# Altium schematic sheet Power_supply.schdoc
size 292 x 168 mm
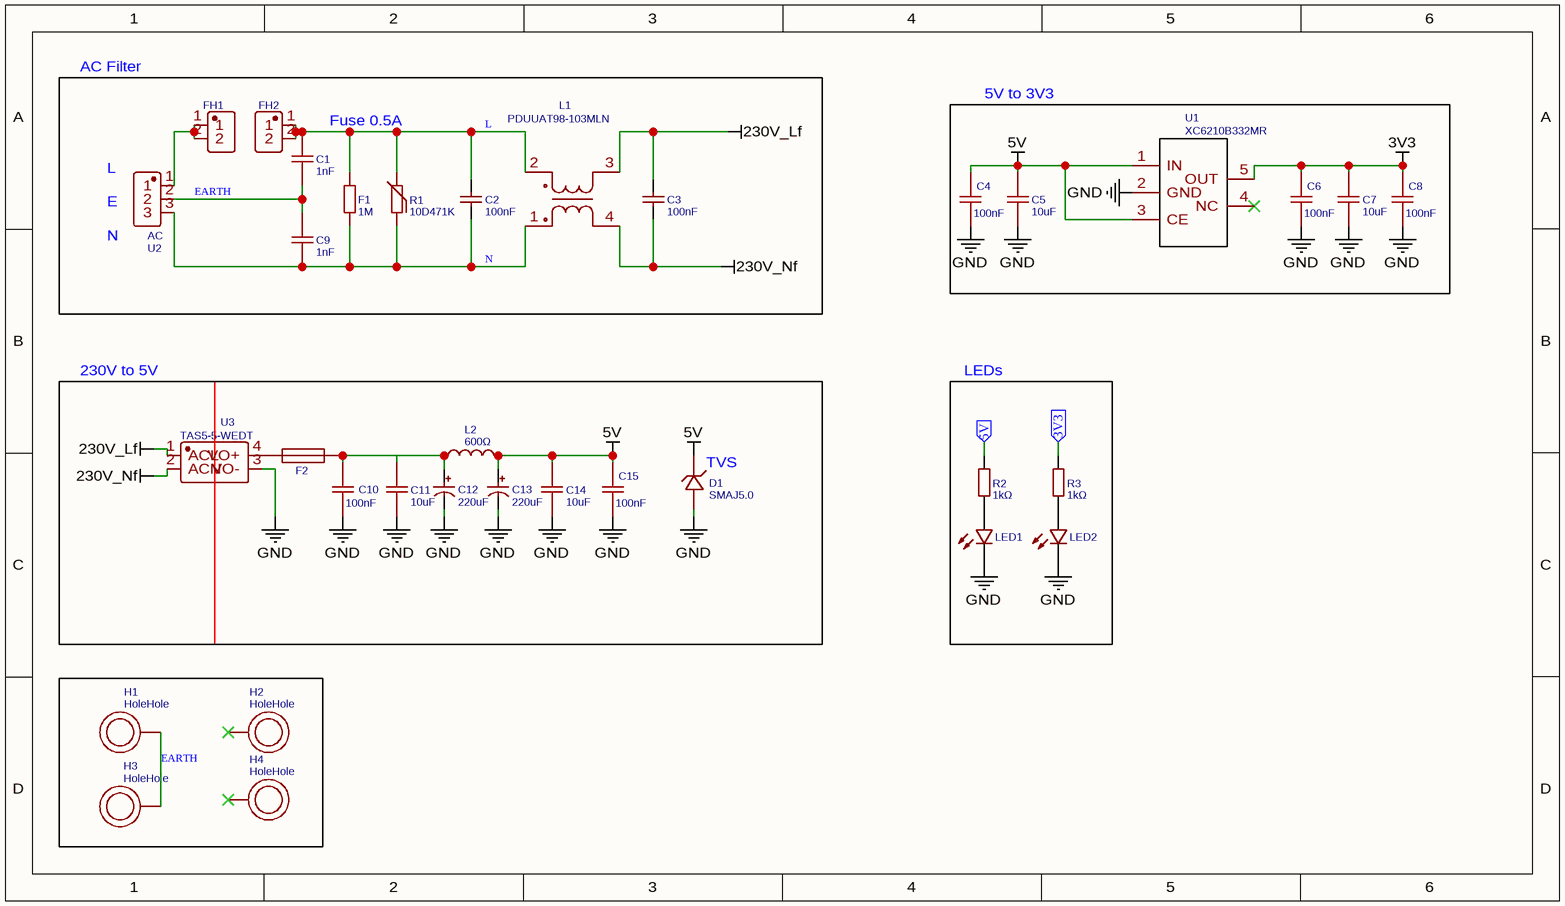
[diagram p0: Power_supply.schdoc]

## Parts
C1  1nF  [CAP-TH_L6.0-W6.0-P5.08-D1.0]
C2  100nF  [18*7.5*13.5/P=15]
C3  100nF  [18*7.5*13.5/P=15]
C4  100nF  [C0603]
C5  10uF  [C0805]
C6  100nF  [C0603]
C7  10uF  [C0805]
C8  100nF  [C0603]
C9  1nF  [CAP-TH_L6.0-W6.0-P5.08-D1.0]
C10  100nF  [C0603]
C11  10uF  [C0805]
C12  220uF  [CAP-TH_BD6.3-P2.50-D1.0-FD]
C13  220uF  [CAP-TH_BD6.3-P2.50-D1.0-FD]
C14  10uF  [C0805]
C15  100nF  [C0603]
D1  SMAJ5.0  [SMA_L4.3-W2.6-LS5.2-RD]
F1  1M  [RES-TH_BD3.3-L9.0-P13.00-D0.6]
F2  BSMD1206-150-16V  [F1206]  (value not drawn)
FH1  LS-601  [FUSE-TH_LS-601]  (value not drawn)
FH2  LS-601  [FUSE-TH_LS-601]  (value not drawn)
H1  HoleHole  [HOLEHOLE]
H2  HoleHole  [HOLEHOLE]
H3  HoleHole  [HOLEHOLE]
H4  HoleHole  [HOLEHOLE]
L1  PDUUAT98-103MLN  [FILTER-TH_4P-L17.0-W12.0-P7.00-D0.6-S8.00-1]
L2  600Ω  [L0805]
LED1  19-213SURC/S530-A3/TR8  [LED0603-RD]  (value not drawn)
LED2  19-213SURC/S530-A3/TR8  [LED0603-RD]  (value not drawn)
R1  10D471K  [RES-TH_L12.5-W6.7-P7.50-D1.2]
R2  1kΩ  [R0603]
R3  1kΩ  [R0603]
U1  XC6210B332MR  [SOT-23-5_L3.0-W1.7-P0.95-LS2.8-BR]
U2  AC  [CONN-TH_3P-P7.62_KF7620-7.62-3P]
U3  TAS5-5-WEDT  [PWRM-TH_TAS5-X-WEDT]

## Blocks framed on the sheet
5V to 3V3: C4-C8 U1
LEDs: LED1 LED2 R2 R3

## Ports
3V3 (in), 5V (in)

## Nets
3V3: C6.2 C7.2 C8.2 U1.5(OUT)
5V: C4.2 C5.2 C13.1 C14.2 C15.2 D1.1(C) L2.2 U1.1(IN) U1.3(CE)
230V_Lf: C3.2 L1.3 U3.1(ACL)
230V_Nf: C3.1 L1.4 U3.2(ACN)
GND: C4.1 C5.1 C6.1 C7.1 C8.1 C10.1 C11.1 C12.2 C13.2 C14.1 C15.1 D1.2(A) LED1.1(C) LED2.1(C) U1.2(GND) U3.3(VO-)
3V3: R3.2 ; port 3V3  [a separate net that carries the same name]
5V: R2.2 ; port 5V  [a separate net that carries the same name]
EARTH: C1.1 C9.2 H1.1 H3.1 U2.2
L: C1.2 C2.2 F1.2 FH2.1 FH2.2 L1.2 R1.2
N: C2.1 C9.1 F1.1 L1.1 R1.1 U2.3
NetC10_2: C10.2 C11.2 C12.1 F2.2 L2.1
NetF2_1: F2.1 U3.4(VO+)
NetFH1_1: FH1.1 FH1.2 U2.1
NetLED1_2: LED1.2(A) R2.1
NetLED2_2: LED2.2(A) R3.1

Not connected (* = marked no-connect by the designer): H2 1*; H4 1*; U1 4(NC)*

## Notes on the sheet
- AC Filter
- (near U2) L
- Fuse 0.5A
- (near U2) N
- (near U2) E
- 230V to 5V
- (near D1) TVS

## Library data of the parts
C1 C9 = 1nF: Manufacturer: Dersonic(德尔创); Manufacturer Part: CC2H102MC24EB45F50MK; nameAlias: Capacitance; Contributor: LCSC; Supplier: LCSC; Supplier Part: C377842; JLCPCB Part Class: Extended Part; spicePre: C; spiceSymbolName: CC2H102MC24EB45F50MK
C2 C3 = 100nF: Manufacturer: KYET; Manufacturer Part: MMKP104J2G1501; Contributor: peteplusgod; Supplier: LCSC; Supplier Part: C2991051; spicePre: C; spiceSymbolName: MPP335J2191222LC
C4 C6 C8 C10 C15 = 100nF: Manufacturer: SAMSUNG; Manufacturer Part: CL10B104KB8NNNC; nameAlias: Capacitance; Supplier: LCSC; Supplier Part: C1591; JLCPCB Part Class: Extended Part; spicePre: C; spiceSymbolName: CL10B104KB8NNNC
C5 C7 C11 C14 = 10uF: Manufacturer: FH; Manufacturer Part: 0805F106M160NT; nameAlias: Capacitance; Supplier: LCSC; Supplier Part: C90545; JLCPCB Part Class: Extended Part; spicePre: C; spiceSymbolName: 0805F106M160NT
C12 C13 = 220uF: Manufacturer: Rubycon; Manufacturer Part: 25YXJ220M6.3X11; nameAlias: Capacitance; Supplier: LCSC; Supplier Part: C88729; JLCPCB Part Class: Extended Part; spicePre: C; spiceSymbolName: 25YXJ220M6.3X11
D1 = SMAJ5.0: Manufacturer Part: SMAJ5.0A; Manufacturer: Brightking; Supplier: LCSC; Supplier Part: C78401; JLCPCB Part Class: Extended Part; spicePre: D; spiceSymbolName: SMAJ5.0A-C78401
F1 = 1M: Manufacturer: YAGEO(国巨); Manufacturer Part: HHV-50JT-52-1M; Resistance: 1MΩ; Contributor: LCSC; Supplier: LCSC; Supplier Part: C1389550; JLCPCB Part Class: Extended Part; spicePre: F; spiceSymbolName: HHV-50JT-52-1M
F2 = BSMD1206-150-16V: Manufacturer: BHFUSE; Contributor: LCSC; Supplier: LCSC; Supplier Part: C883133; Manufacturer Part: BSMD1206-150-16V; JLCPCB Part Class: Extended Part; spicePre: F; spiceSymbolName: BSMD1206-150-16V
FH1 FH2 = LS-601: Manufacturer: LANSON(良胜); Contributor: LCSC; Supplier: LCSC; Supplier Part: C182321; Manufacturer Part: LS-601; JLCPCB Part Class: Extended Part; spicePre: F; spiceSymbolName: LS-601
H1-H4 = HoleHole: Contributor: Cillié Malan; spicePre: H; spiceSymbolName: HoleHole
L1 = PDUUAT98-103MLN: Manufacturer: PROD(谱罗德); Contributor: LCSC; Supplier: LCSC; Supplier Part: C2909797; Manufacturer Part: PDUUAT98-103MLN; JLCPCB Part Class: Extended Part; spicePre: L; spiceSymbolName: PDUUAT98-103MLN
L2 = 600Ω: Manufacturer: FH; Manufacturer Part: CBW201209U601T; nameAlias: Value; Supplier: LCSC; Supplier Part: C21286; JLCPCB Part Class: Extended Part; spicePre: L; spiceSymbolName: CBW201209U601T
LED1 LED2 = 19-213SURC/S530-A3/TR8: Manufacturer: EVERLIGHT(亿光); Supplier: LCSC; Manufacturer Part: 19-213SURC/S530-A3/TR8; Supplier Part: C72039; JLCPCB Part Class: Extended Part; spicePre: L; spiceSymbolName: 19-213SURC/S530-A3/TR8
R1 = 10D471K: Manufacturer: RUILON; Supplier: LCSC; Manufacturer Part: 10D471K; Supplier Part: C8760; JLCPCB Part Class: Extended Part; spicePre: R; spiceSymbolName: 10D471K-C8760
R2 R3 = 1kΩ: Manufacturer: FH; Manufacturer Part: RS-03K1001FT; nameAlias: Resistance; Resistance (Ohms): 1K; Supplier: LCSC; Supplier Part: C115325; JLCPCB Part Class: Extended Part; spicePre: R; spiceSymbolName: RS-03K1001FT
U1 = XC6210B332MR: Manufacturer: TOREX; Supplier: LCSC; Manufacturer Part: XC6210B332MR; Supplier Part: C47719; JLCPCB Part Class: Extended Part; spicePre: U; spiceSymbolName: XC6210B332MR
U2 = AC: Manufacturer: KEFA(科发); Manufacturer Part: KF7620-7.62-3P; Contributor: LCSC; Supplier: LCSC; Supplier Part: C475105; JLCPCB Part Class: Extended Part; spicePre: U; spiceSymbolName: KF7620-7.62-3P
U3 = TAS5-5-WEDT: Manufacturer: TDPOWER(腾达电源); Contributor: LCSC; Supplier: LCSC; Supplier Part: C2687651; Manufacturer Part: TAS5-5-WEDT; JLCPCB Part Class: Extended Part; spicePre: U; spiceSymbolName: TAS5-5-WEDT